# EAGLE schematic Arduino-DIP (EAGLE 6.6.0)
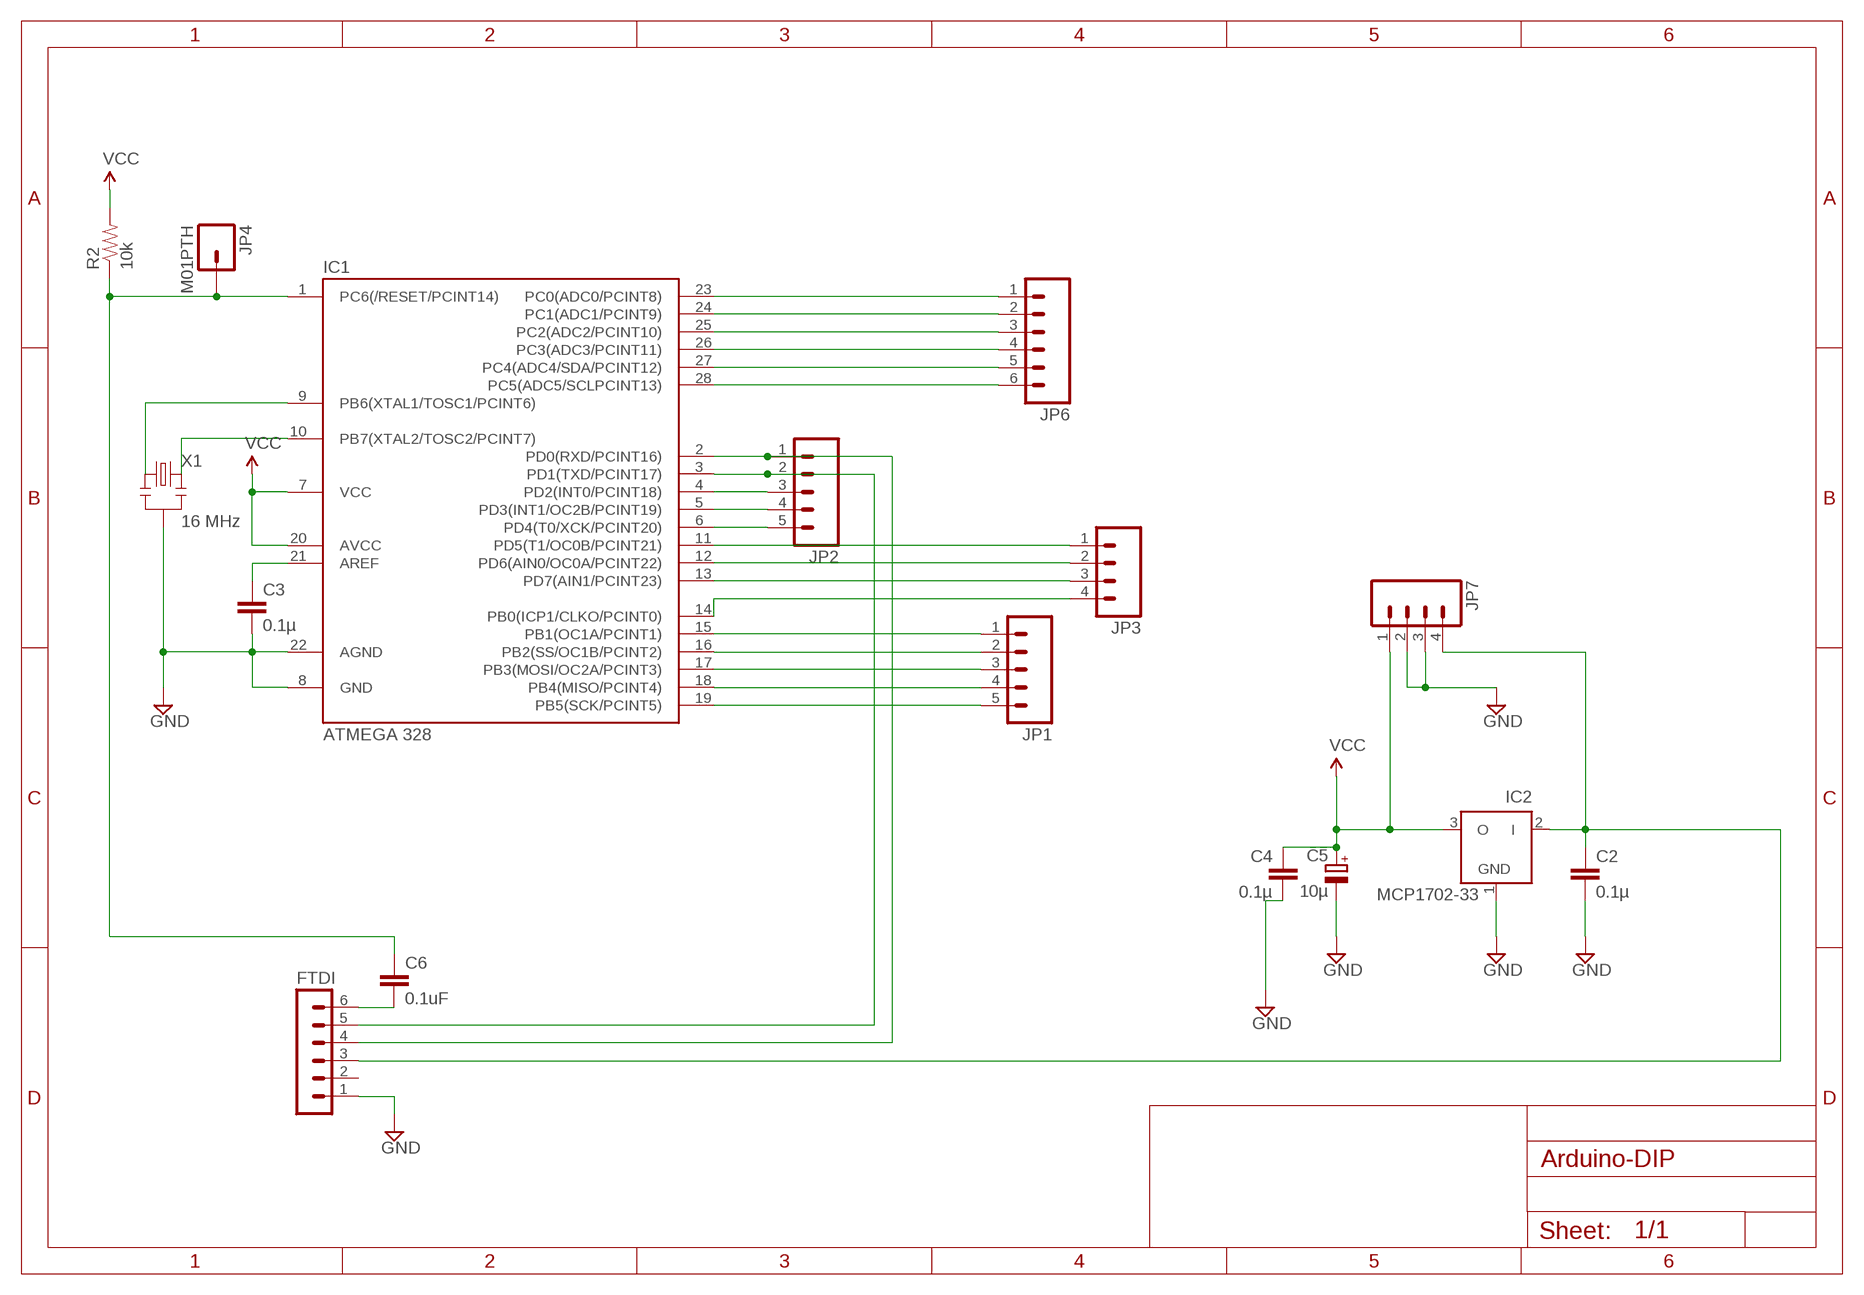
[diagram p0: schematic, sheet 1]

## Parts
C2  0.1µ  C-EU025-024X044  [C025-024X044]
C3  0.1µ  C-EU025-024X044  [C025-024X044]
C4  0.1µ  C-EU025-024X044  [C025-024X044]
C5  10µ  CPOL-EUE1.8-4  [E1,8-4]
C6  0.1uF  CAPPTH1  [CAP-PTH-5MM]
FTDI  FTDI  MA06-1  [MA06-1]
IC1  ATMEGA 328  ATMEGA48/88/168-PU  [DIL28-3]
IC2  MCP1702-33  MCP1702Z  [TO92]
JP1  M05PTH  [1X05]
JP2  M05PTH  [1X05]
JP3  M04PTH  [1X04]
JP4  M01PTH  [1X01]
JP6  M06NO_SILK  [1X06_NO_SILK]
JP7  M04PTH  [1X04]
R2  10k  RESISTORPTH-1/6W  [1/6W-RES]
X1  16 MHz  RESONATORPTH  [RESONATOR-PTH]

## Nets
GND [power]: C2.2 C3.2 C4.2 C5.- FTDI.1 IC1.8(GND) IC1.22(AGND) IC2.1(GND) JP7.2 JP7.3 X1.2
N$1: IC1.9(PB6(XTAL1/TOSC1/PCINT6)) X1.1
N$2: IC1.23(PC0(ADC0/PCINT8)) JP6.1
N$3: IC1.24(PC1(ADC1/PCINT9)) JP6.2
N$4: IC1.25(PC2(ADC2/PCINT10)) JP6.3
N$5: IC1.26(PC3(ADC3/PCINT11)) JP6.4
N$6: IC1.27(PC4(ADC4/SDA/PCINT12)) JP6.5
N$7: IC1.28(PC5(ADC5/SCLPCINT13)) JP6.6
N$8: IC1.4(PD2(INT0/PCINT18)) JP2.3
N$9: IC1.5(PD3(INT1/OC2B/PCINT19)) JP2.4
N$10: IC1.6(PD4(T0/XCK/PCINT20)) JP2.5
N$11: IC1.11(PD5(T1/OC0B/PCINT21)) JP3.1
N$12: IC1.12(PD6(AIN0/OC0A/PCINT22)) JP3.2
N$13: IC1.13(PD7(AIN1/PCINT23)) JP3.3
N$14: IC1.14(PB0(ICP1/CLKO/PCINT0)) JP3.4
N$15: IC1.15(PB1(OC1A/PCINT1)) JP1.1
N$16: IC1.16(PB2(SS/OC1B/PCINT2)) JP1.2
N$17: IC1.17(PB3(MOSI/OC2A/PCINT3)) JP1.3
N$18: IC1.18(PB4(MISO/PCINT4)) JP1.4
N$19: C3.1 IC1.21(AREF)
N$20: C6.2 FTDI.6
N$21: IC1.10(PB7(XTAL2/TOSC2/PCINT7)) X1.3
N$22: IC1.19(PB5(SCK/PCINT5)) JP1.5
PWR [power]: C2.1 FTDI.3 IC2.2(I) JP7.4
RST: C6.1 IC1.1(PC6(/RESET/PCINT14)) JP4.1 R2.1
RXD: FTDI.4 IC1.2(PD0(RXD/PCINT16)) JP2.1
TXD: FTDI.5 IC1.3(PD1(TXD/PCINT17)) JP2.2
VCC [power]: C4.1 C5.+ IC1.7(VCC) IC1.20(AVCC) IC2.3(O) JP7.1 R2.2
Unconnected: FTDI.2

## Library data of the parts
C2-C4 = resistor:C-EU: CAPACITOR, European symbol
C5 = resistor:CPOL-EU: POLARIZED CAPACITOR, European symbol
C6 = SparkFun-Capacitors:CAP: Capacitor Standard 0603 ceramic capacitor, and 0.1" leaded capacitor.
FTDI = JeeLabs:MA06-1: PIN HEADER
IC1 = atmega8:ATMEGA48/88/168-PU
IC2 = JeeLabs:MCP1702: 200 mA, Low Power Low Dropout Voltage Regulator
JP1 JP2 = SparkFun-Connectors:M05: Header 5 Standard 5-pin 0.1" header. Use with straight break away headers (SKU : PRT-00116), right angle break away headers (PRT-00553), swiss pins (PRT-00743), machine pins (PRT-00117), and female headers (PRT-00115). Molex polarized connector foot print use with SKU : PRT-08230 with associated crimp pins and housings.
JP3 JP7 = SparkFun-Connectors:M04: Header 4 Standard 4-pin 0.1" header. Use with straight break away headers (SKU : PRT-00116), right angle break away headers (PRT-00553), swiss pins (PRT-00743), machine pins (PRT-00117), and female headers (PRT-00115). Molex polarized connector foot print use with SKU : PRT-08231 with associated crimp pins and housings. 1MM SMD Version SKU: PRT-10208
JP4 = SparkFun-Connectors:M01: Header 1 Standard 1-pin 0.1" header. Use with straight break away headers (SKU : PRT-00116), right angle break away headers (PRT-00553), swiss pins (PRT-00743), machine pins (PRT-00117), and female headers (PRT-00115).
JP6 = SparkFun-Connectors:M06: Header 6 Standard 6-pin 0.1" header. Use with straight break away headers (SKU : PRT-00116), right angle break away headers (PRT-00553), swiss pins (PRT-00743), machine pins (PRT-00117), and female headers (PRT-00115). Molex polarized connector foot print use with SKU : PRT-08094 with associated crimp pins and housings. NOTES ON THE VARIANTS LOCK and LOCK_LONGPADS... This footprint was designed to help hold the alignment of a through-hole component (i.e. 6-pin header) while soldering it into place. You may notice that each hole has been shifted either up or down by 0.005 of an inch from it's more standard position (which is a perfectly straight line). This slight alteration caused the pins (the squares in the middle) to touch the edges of the holes. Because they are alternating, it causes a "brace" to hold the component in place. 0.005 has proven to be the perfect amount of "off-center" position when using our standard breakaway headers. Although looks a little odd when you look at the bare footprint, once you have a header in there, the alteration is very hard to notice. Also,if you push a header all the way into place, it is covered up entirely on the bottom side. This idea of altering the position of holes to aid alignment will be further integrated into the Sparkfun Library for other footprints. It can help hold any component with 3 or more connection pins.
R2 = SparkFun-Passives:RESISTOR: Resistor Basic schematic elements and footprints for 0603, 1206, and PTH resistors.
X1 = SparkFun:RESONATOR: Resonator Small SMD resonator. This is the itty bitty 10/20MHz resonators with built in caps. CSTCE10M0G55 and CSTCE20M0V53. Footprint has been reviewed closely but hasn't been tested yet.

## Net classes
1 power: width 0.406 mm